# EAGLE schematic sqore (EAGLE 7.3.0)
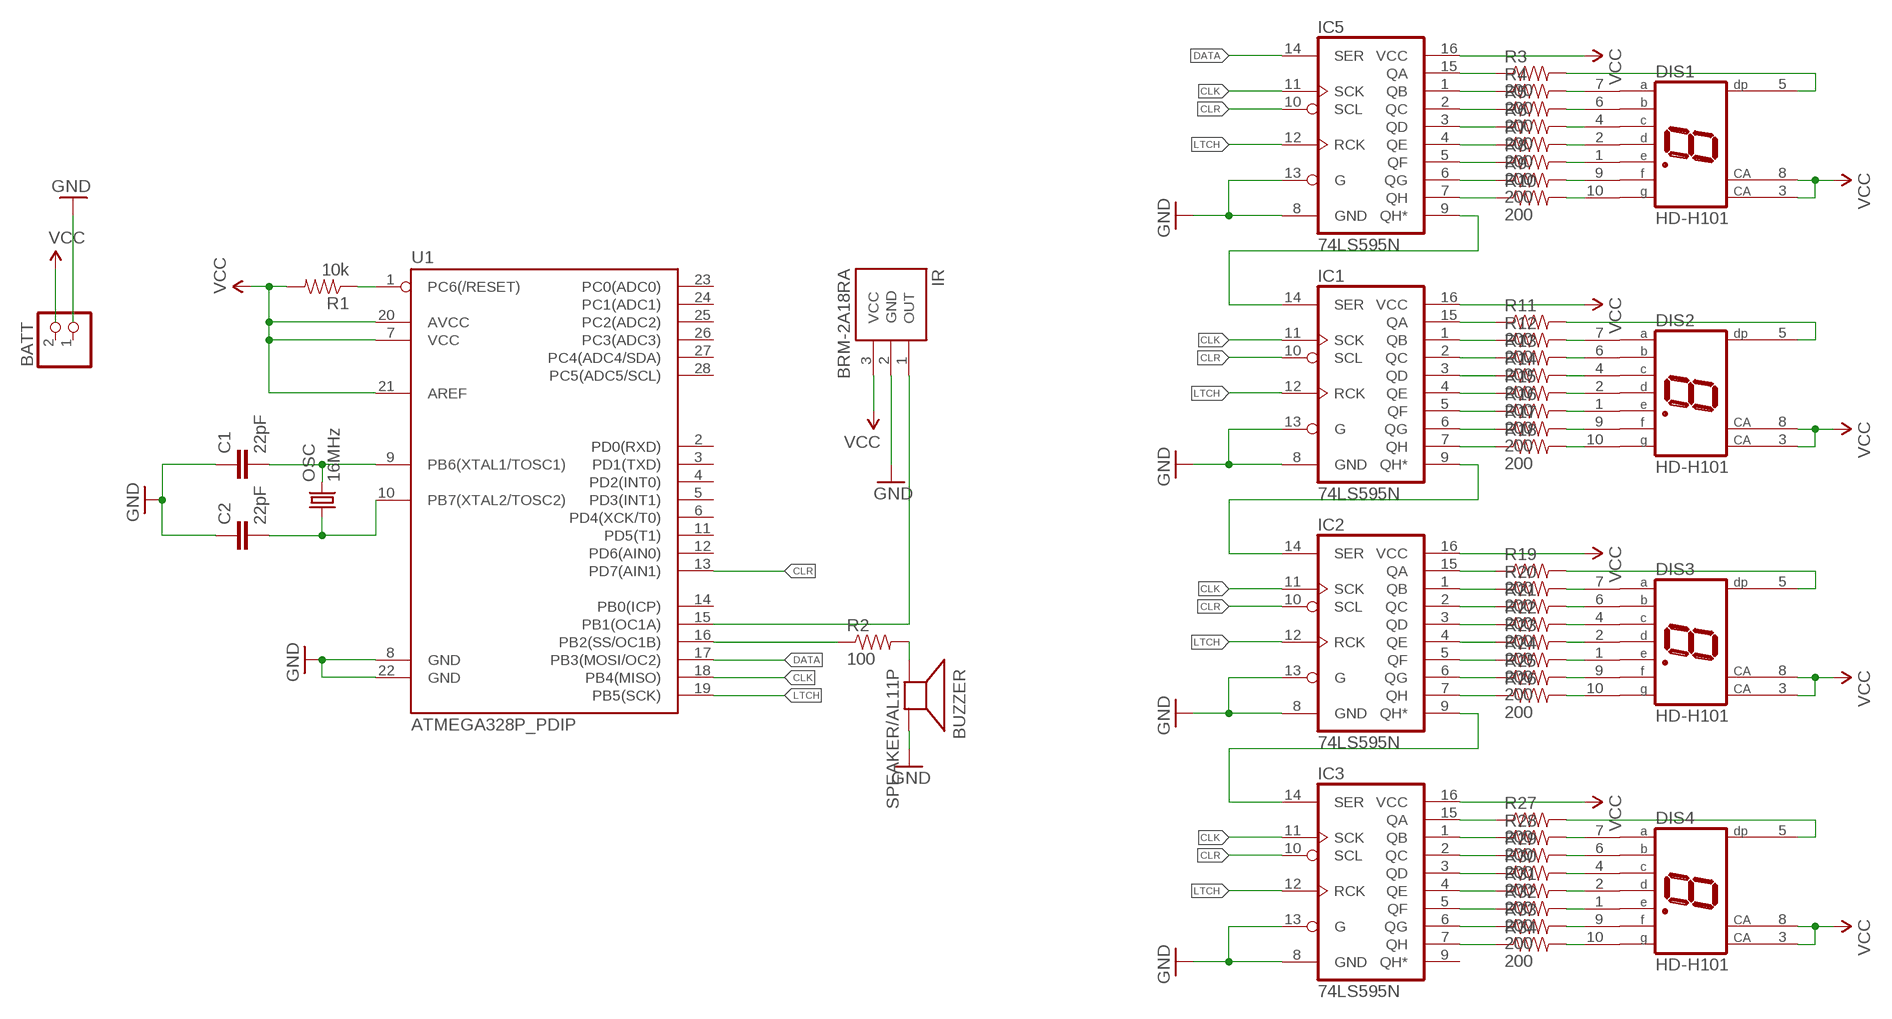
[diagram p0: schematic, sheet 1]

## Parts
BATT  JST_2PIN-THM  [JST-PH-2-THM]
BUZZER  SPEAKER/AL11P  [AL11P]
C1  22pF  CAPKIT  [CAP-PTH-SMALL-KIT]
C2  22pF  CAPKIT  [CAP-PTH-SMALL-KIT]
DIS1  HD-H101  [HDSP-M]
DIS2  HD-H101  [HDSP-M]
DIS3  HD-H101  [HDSP-M]
DIS4  HD-H101  [HDSP-M]
IC1  74LS595N  [DIL16]
IC2  74LS595N  [DIL16]
IC3  74LS595N  [DIL16]
IC5  74LS595N  [DIL16]
IR  BRM-2A18RA  [BRM-2508]
OSC  16MHz  CRYSTALHC49US  [HC49US]
R1  10k  RESISTORKIT  [AXIAL-0.3-KIT]
R2  100  RESISTORKIT  [AXIAL-0.3-KIT]
R3  200  RESISTORKIT  [AXIAL-0.3-KIT]
R4  200  RESISTORKIT  [AXIAL-0.3-KIT]
R5  200  RESISTORKIT  [AXIAL-0.3-KIT]
R6  200  RESISTORKIT  [AXIAL-0.3-KIT]
R7  200  RESISTORKIT  [AXIAL-0.3-KIT]
R8  200  RESISTORKIT  [AXIAL-0.3-KIT]
R9  200  RESISTORKIT  [AXIAL-0.3-KIT]
R10  200  RESISTORKIT  [AXIAL-0.3-KIT]
R11  200  RESISTORKIT  [AXIAL-0.3-KIT]
R12  200  RESISTORKIT  [AXIAL-0.3-KIT]
R13  200  RESISTORKIT  [AXIAL-0.3-KIT]
R14  200  RESISTORKIT  [AXIAL-0.3-KIT]
R15  200  RESISTORKIT  [AXIAL-0.3-KIT]
R16  200  RESISTORKIT  [AXIAL-0.3-KIT]
R17  200  RESISTORKIT  [AXIAL-0.3-KIT]
R18  200  RESISTORKIT  [AXIAL-0.3-KIT]
R19  200  RESISTORKIT  [AXIAL-0.3-KIT]
R20  200  RESISTORKIT  [AXIAL-0.3-KIT]
R21  200  RESISTORKIT  [AXIAL-0.3-KIT]
R22  200  RESISTORKIT  [AXIAL-0.3-KIT]
R23  200  RESISTORKIT  [AXIAL-0.3-KIT]
R24  200  RESISTORKIT  [AXIAL-0.3-KIT]
R25  200  RESISTORKIT  [AXIAL-0.3-KIT]
R26  200  RESISTORKIT  [AXIAL-0.3-KIT]
R27  200  RESISTORKIT  [AXIAL-0.3-KIT]
R28  200  RESISTORKIT  [AXIAL-0.3-KIT]
R29  200  RESISTORKIT  [AXIAL-0.3-KIT]
R30  200  RESISTORKIT  [AXIAL-0.3-KIT]
R31  200  RESISTORKIT  [AXIAL-0.3-KIT]
R32  200  RESISTORKIT  [AXIAL-0.3-KIT]
R33  200  RESISTORKIT  [AXIAL-0.3-KIT]
R34  200  RESISTORKIT  [AXIAL-0.3-KIT]
U1  ATMEGA328P_PDIP  [DIL28-3]

## Nets
CLK: IC1.11(SCK) IC2.11(SCK) IC3.11(SCK) IC5.11(SCK) U1.18(PB4(MISO))
CLR: IC1.10(SCL) IC2.10(SCL) IC3.10(SCL) IC5.10(SCL) U1.13(PD7(AIN1))
DATA: IC5.14(SER) U1.17(PB3(MOSI/OC2))
GND: BUZZER.- C1.1 C2.1 IC1.8(GND) IC1.13(G) IC2.8(GND) IC2.13(G) IC3.8(GND) IC3.13(G) IC5.8(GND) IC5.13(G) IR.2(GND) U1.8(GND) U1.22(GND)
LTCH: IC1.12(RCK) IC2.12(RCK) IC3.12(RCK) IC5.12(RCK) U1.19(PB5(SCK))
N$1: R1.P$1 U1.1(PC6(/RESET))
N$2: C2.2 OSC.1 U1.10(PB7(XTAL2/TOSC2))
N$3: C1.2 OSC.2 U1.9(PB6(XTAL1/TOSC1))
N$4: IR.1(OUT) U1.15(PB1(OC1A))
N$5: R2.P$1 U1.16(PB2(SS/OC1B))
N$6: BUZZER.+ R2.P$2
N$7: IC5.7(QH) R10.P$1
N$8: IC5.6(QG) R9.P$1
N$9: IC5.5(QF) R8.P$1
N$10: IC5.4(QE) R7.P$1
N$11: IC5.3(QD) R6.P$1
N$12: IC5.2(QC) R5.P$1
N$13: IC5.1(QB) R4.P$1
N$14: IC5.15(QA) R3.P$1
N$15: DIS1.10(G) R10.P$2
N$16: DIS1.9(F) R9.P$2
N$17: DIS1.1(E) R8.P$2
N$18: DIS1.2(D) R7.P$2
N$19: DIS1.4(C) R6.P$2
N$20: DIS1.6(B) R5.P$2
N$21: DIS1.7(A) R4.P$2
N$22: DIS1.5(DP) R3.P$2
N$23: IC1.14(SER) IC5.9(QH*)
N$24: IC1.7(QH) R18.P$1
N$25: IC1.6(QG) R17.P$1
N$26: IC1.5(QF) R16.P$1
N$27: IC1.4(QE) R15.P$1
N$28: IC1.3(QD) R14.P$1
N$29: IC1.2(QC) R13.P$1
N$30: IC1.1(QB) R12.P$1
N$31: IC1.15(QA) R11.P$1
N$32: DIS2.10(G) R18.P$2
N$33: DIS2.9(F) R17.P$2
N$34: DIS2.1(E) R16.P$2
N$35: DIS2.2(D) R15.P$2
N$36: DIS2.4(C) R14.P$2
N$37: DIS2.6(B) R13.P$2
N$38: DIS2.7(A) R12.P$2
N$39: DIS2.5(DP) R11.P$2
N$40: IC2.7(QH) R26.P$1
N$41: IC2.6(QG) R25.P$1
N$42: IC2.5(QF) R24.P$1
N$43: IC2.4(QE) R23.P$1
N$44: IC2.3(QD) R22.P$1
N$45: IC2.2(QC) R21.P$1
N$46: IC2.1(QB) R20.P$1
N$47: IC2.15(QA) R19.P$1
N$48: DIS3.10(G) R26.P$2
N$49: DIS3.9(F) R25.P$2
N$50: DIS3.1(E) R24.P$2
N$51: DIS3.2(D) R23.P$2
N$52: DIS3.4(C) R22.P$2
N$53: DIS3.6(B) R21.P$2
N$54: DIS3.7(A) R20.P$2
N$55: DIS3.5(DP) R19.P$2
N$56: IC3.7(QH) R34.P$1
N$57: IC3.6(QG) R33.P$1
N$58: IC3.5(QF) R32.P$1
N$59: IC3.4(QE) R31.P$1
N$60: IC3.3(QD) R30.P$1
N$61: IC3.2(QC) R29.P$1
N$62: IC3.1(QB) R28.P$1
N$63: IC3.15(QA) R27.P$1
N$64: DIS4.10(G) R34.P$2
N$65: DIS4.9(F) R33.P$2
N$66: DIS4.1(E) R32.P$2
N$67: DIS4.2(D) R31.P$2
N$68: DIS4.4(C) R30.P$2
N$69: DIS4.6(B) R29.P$2
N$70: DIS4.7(A) R28.P$2
N$71: DIS4.5(DP) R27.P$2
N$72: IC1.9(QH*) IC2.14(SER)
N$73: IC2.9(QH*) IC3.14(SER)
VCC: DIS1.3(CA) DIS1.8(CA) DIS2.3(CA) DIS2.8(CA) DIS3.3(CA) DIS3.8(CA) DIS4.3(CA) DIS4.8(CA) IC1.16(VCC) IC2.16(VCC) IC3.16(VCC) IC5.16(VCC) IR.3(VCC) R1.P$2 U1.7(VCC) U1.20(AVCC) U1.21(AREF)
Unconnected: BATT.1 BATT.2 IC3.9(QH*) U1.2(PD0(RXD)) U1.3(PD1(TXD)) U1.4(PD2(INT0)) U1.5(PD3(INT1)) U1.6(PD4(XCK/T0)) U1.11(PD5(T1)) U1.12(PD6(AIN0)) U1.14(PB0(ICP)) U1.23(PC0(ADC0)) U1.24(PC1(ADC1)) U1.25(PC2(ADC2)) U1.26(PC3(ADC3)) U1.27(PC4(ADC4/SDA)) U1.28(PC5(ADC5/SCL))

## Library data of the parts
BATT = adafruit:JST_2PIN: JST 2-Pin Connectors of various flavors SMT-RA (S2B-PH-SM4) 4UConnector #17311 SMT (B2B-PH-SM4) THM-RA (S2B-PH) THM (B2B-PH)
BUZZER = adafruit:SPEAKER: SPEAKER Source: Buerklin Added PS12 (for part # PS1240 piezo) http://www.ladyada.net/library/pcb/eaglelibrary.html
C1 C2 = SparkFun-Capacitors:CAP: Capacitor Standard 0603 ceramic capacitor, and 0.1" leaded capacitor.
DIS1-DIS4 = display-hp:HD-H101: LED DISPLAY 1-character 7 segment, decimal point right; OC_FARNELL: unknown; OC_NEWARK: unknown
IC1-IC3 IC5 = SparkFun-DigitalIC:74*595: 8-bit SHIFT REGISTER, output latch
IR = SparkFun-Sensors:BRM-2A18: BRM-2A18 IR receiver.
OSC = SparkFun-FreqCtrl:CRYSTAL: Various standard crystals. Proven footprints.
R1-R34 = SparkFun-Resistors:RESISTOR: Resistor Basic schematic elements and footprints for 0603, 1206, and PTH resistors.
U1 = SparkFun-DigitalIC:ATMEGA328P_PDIP: uC used in the Arduino 32kb flash, 1k EEPROM, 2k SRAM This is the through-hole version of this chip.